# Altium project SeniorProject.PrjPCB
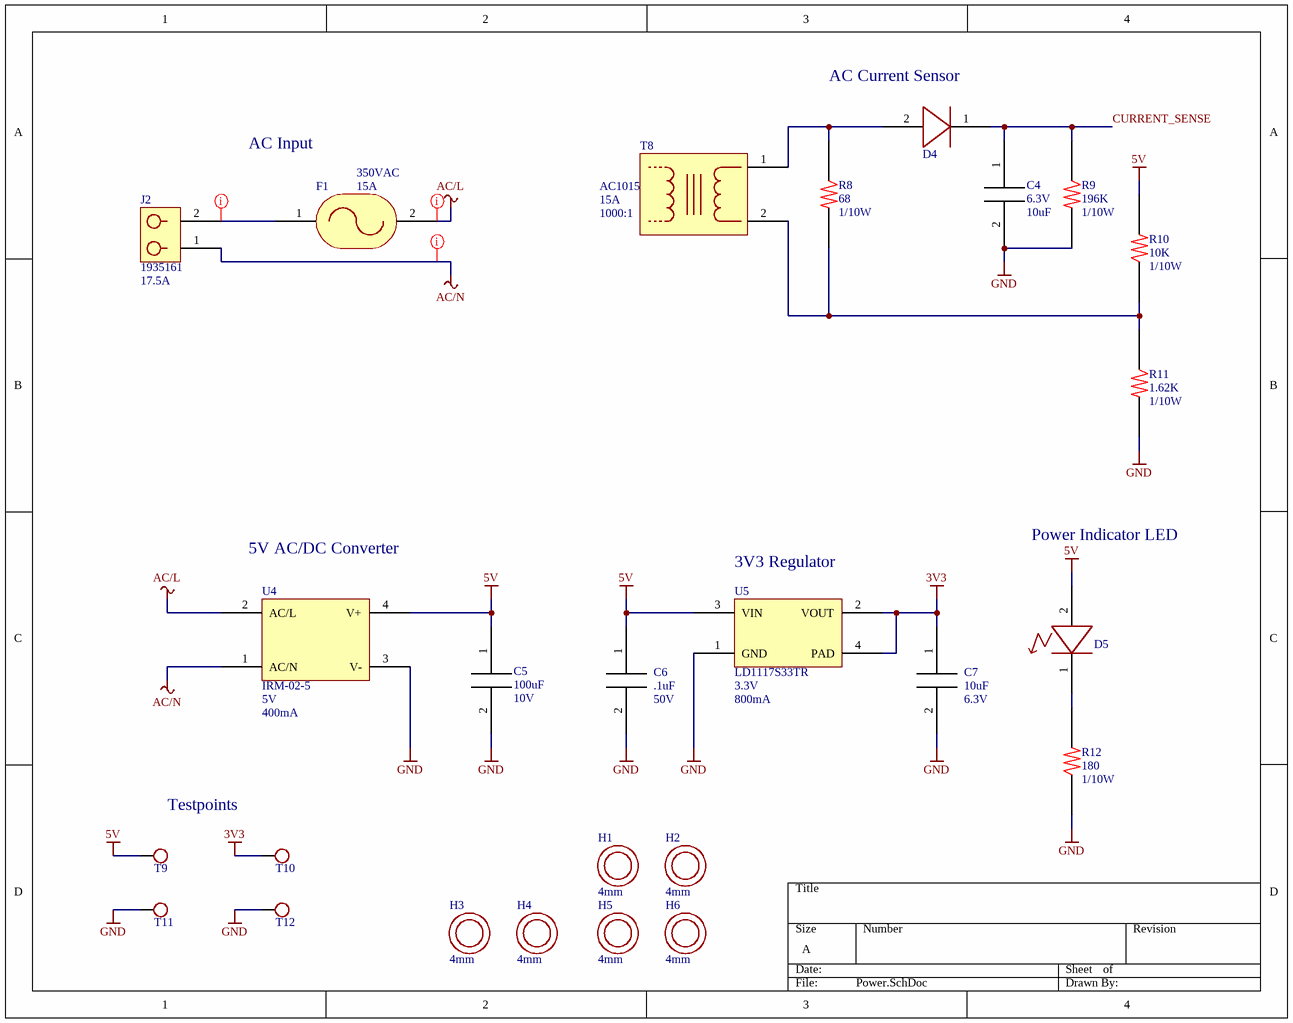
[diagram p0: Power.SchDoc]
4 sheets, 96 parts. Net scope: global (net labels, ports and power ports of the same name join across sheets).
Board file: LightSwitch.PcbDoc
Sheets:
  Power.SchDoc
  Dimmer.SchDoc
  XBee.SchDoc
  Logic.SchDoc

## Sheet Power.SchDoc
size A

### Parts
(Parts that share a designator on the sheet are numbered #1, #2 ... from top to bottom, then left to right.)
C4#1  value 10uF  Rating: 6.3V  [0603]  (hidden comment: C_CAP_0603)
C5#1  value 100uF  Rating: 10V  [1210]  (hidden comment: C_CAP_1210)
C6#1  value .1uF  Rating: 50V  [0603]  (hidden comment: C_CAP_0603)
C7#1  value 10uF  Rating: 6.3V  [0603]  (hidden comment: C_CAP_0603)
D4#1  D_DIODE_SOD123  [SOD123]  (value not drawn)
D5#1  D_LED_LED5MM  [LED5MM]  (value not drawn)
F1  value 15A  Rating: 350VAC  [2410]  (hidden comment: F_FUSE_2410)
H1  value 4mm  [MOUNTHOLE4MM]  (hidden comment: H_MOUNTHOLE_MOUNTHOLE4MM)
H2  value 4mm  [MOUNTHOLE4MM]  (hidden comment: H_MOUNTHOLE_MOUNTHOLE4MM)
H3  value 4mm  [MOUNTHOLE4MM]  (hidden comment: H_MOUNTHOLE_MOUNTHOLE4MM)
H4  value 4mm  [MOUNTHOLE4MM]  (hidden comment: H_MOUNTHOLE_MOUNTHOLE4MM)
H5  value 4mm  [MOUNTHOLE4MM]  (hidden comment: H_MOUNTHOLE_MOUNTHOLE4MM)
H6  value 4mm  [MOUNTHOLE4MM]  (hidden comment: H_MOUNTHOLE_MOUNTHOLE4MM)
J2#1  Rating: 17.5A  [1935161]  (hidden comment: J_2POSTERM_1935161)
R8#1  value 68  Rating: 1/10W  [0603]  (hidden comment: R_RES_0603)
R9  value 196K  Rating: 1/10W  [0603]  (hidden comment: R_RES_0603)
R10#1  value 10K  Rating: 1/10W  [0603]  (hidden comment: R_RES_0603)
R11#1  value 1.62K  Rating: 1/10W  [0603]  (hidden comment: R_RES_0603)
R12#1  value 180  Rating: 1/10W  [0603]  (hidden comment: R_RES_0603)
T8  value 1000:1  Rating: 15A  [AC1015]  (hidden comment: T_CURRTRANS_AC1015)
T9  TESTPOINT  [TESTPOINT1MM]  (value not drawn)
T10  TESTPOINT  [TESTPOINT1MM]  (value not drawn)
T11  TESTPOINT  [TESTPOINT1MM]  (value not drawn)
T12  TESTPOINT  [TESTPOINT1MM]  (value not drawn)
U4  value 5V  Rating: 400mA  [IRM-02-5]  (hidden comment: U_IRM-02-5_IRM-02-5)
U5  value 3.3V  Rating: 800mA  PartNumber: LD1117S33TR  [SOT223]  (hidden comment: U_LD1117S33TR_SOT223)

### Nets
3V3: C7#1.1 T10.1 U5.2(VOUT) U5.4(PAD)
5V: C5#1.1 C6#1.1 D5#1.2 R10#1.2 T9.1 U4.4(V+) U5.3(VIN)
AC/L: F1.2 U4.2(AC/L)
AC/N: J2#1.1 U4.1(AC/N)
GND: C4#1.2 C5#1.2 C6#1.2 C7#1.2 R9.2 R11#1.2 R12#1.1 T11.1 T12.1 U4.3(V-) U5.1(GND)
CURRENT_SENSE: C4#1.1 D4#1.1 R9.1
NetD4#1_2: D4#1.2 R8#1.1 T8.1
NetD5#1_1: D5#1.1 R12#1.2
NetF1_1: F1.1 J2#1.2
NetR8#1_2: R8#1.2 R10#1.1 R11#1.1 T8.2

### Layout directives
rule Width Constraint [Pref Width = 100mil    Min Width = 15mil    Max Width = 250mil]; rule Clearance Constraint [Generic clearance = 45mil, and 18 value(s) for objects]: AC/L, AC/N, NetF1_1

### Notes on the sheet
- (near D4#1) AC Current Sensor
- AC Input
- 5V AC/DC Converter
- (near U5) 3V3 Regulator
- Power Indicator LED
- Testpoints

### Library data of the parts
C4#1 C7#1 = C_CAP_0603: PartNumber: JMK107ABJ106MA-T; Manufacturer: Taiyo Yuden
C5#1 = C_CAP_1210: PartNumber: GRM32ER61A107ME20L; Manufacturer: Murata
C6#1 = C_CAP_0603: PartNumber: C0603C104K5RACAUTO; Manufacturer: KEMET
D4#1 = D_DIODE_SOD123: PartNumber: BAS16GWJ; Manufacturer: Nexperia USA Inc; Rating: 215mA
F1 = F_FUSE_2410: PartNumber: 0679H9150-05; Manufacturer: Bel Fuse
J2#1 = J_2POSTERM_1935161: Manufacturer: Phoenix Contact; PartNumber: 1935161
R8#1 = R_RES_0603: PartNumber: RC0603FR-0768RL; Manufacturer: Yageo
R9 = R_RES_0603: PartNumber: RC0603FR-07196KL; Manufacturer: Yageo
R10#1 = R_RES_0603: PartNumber: RC0603JR-0710KL; Manufacturer: Yageo
R11#1 = R_RES_0603: PartNumber: RC0603FR-071K62L; Manufacturer: Yageo
R12#1 = R_RES_0603: PartNumber: RC0603JR-07180RL; Manufacturer: Yageo
T8 = T_CURRTRANS_AC1015: Manufacturer: Acme Electric/Amveco/Actown; PartNumber: AC1015
T9-T12 = T_TESTPOINT_TESTPOINT1MM: Value: 1mm
U5 = U_LD1117S33TR_SOT223: Manufacturer: STM
H1-H6 = H_MOUNTHOLE_MOUNTHOLE4MM: PartNumber: *
U4 = U_IRM-02-5_IRM-02-5: PartNumber: IRM-02-5

## Sheet Dimmer.SchDoc
size A4
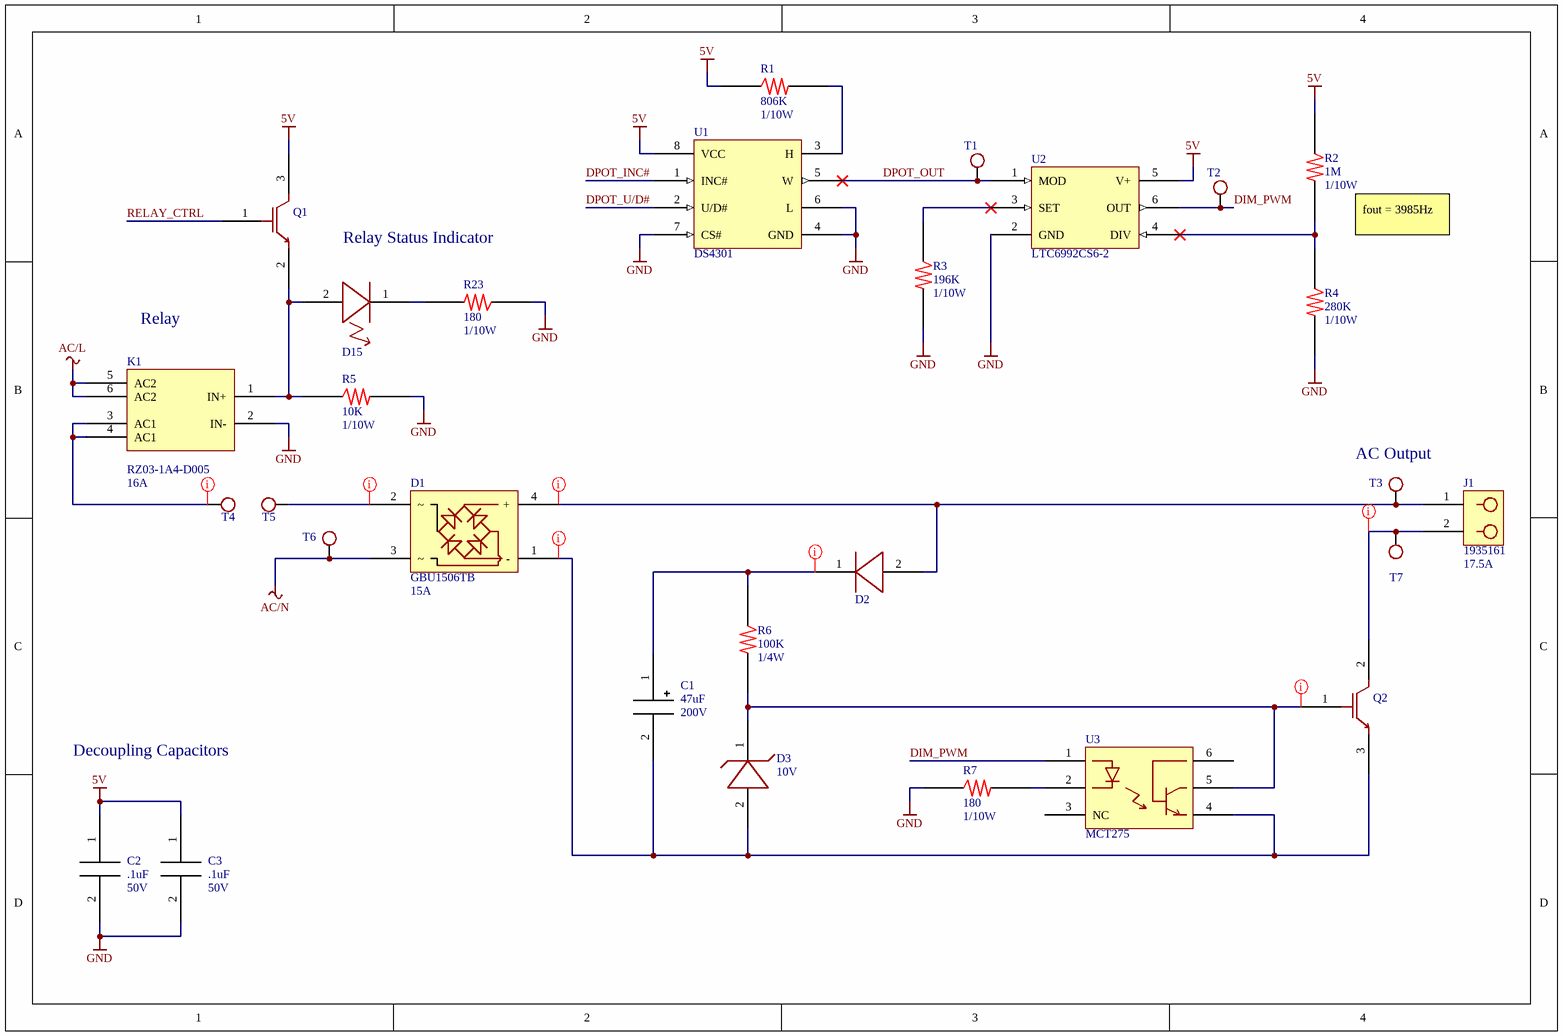
[diagram p1: Dimmer.SchDoc]

### Parts
(Parts that share a designator on the sheet are numbered #1, #2 ... from top to bottom, then left to right.)
C1#1  value 47uF  Rating: 200V  [CAP12.5X20]  (hidden comment: CAP)
C2#1  value .1uF  Rating: 50V  [0603]  (hidden comment: C_CAP_0603)
C3#1  value .1uF  Rating: 50V  [0603]  (hidden comment: C_CAP_0603)
D1  Rating: 15A  PartNumber: GBU1506TB  [GBU]  (hidden comment: D_RECTBRIDGE_GBU1506TB)
D2  D_DIODE_SOD123  [SOD123]  (value not drawn)
D3#1  value 10V  [SOD323]  (hidden comment: D_ZENER_SOD323)
D15  D_LED_LED5MM  [LED5MM]  (value not drawn)
J1#1  Rating: 17.5A  [1935161]  (hidden comment: J_2POSTERM_1935161)
K1  Rating: 16A  [RZ03-1A4-D005]  (hidden comment: K_RELAY-RZ03-1A4_RZ03-1A4-D005)
Q1  Q_NFET_SOT23  [SOT23]  (value not drawn)
Q2  Q_NFET_TO252  [TO252]  (value not drawn)
R1#1  value 806K  Rating: 1/10W  [0603]  (hidden comment: R_RES_0603)
R2#1  value 1M  Rating: 1/10W  [0603]  (hidden comment: R_RES_0603)
R3  value 196K  Rating: 1/10W  [0603]  (hidden comment: R_RES_0603)
R4#1  value 280K  Rating: 1/10W  [0603]  (hidden comment: R_RES_0603)
R5  value 10K  Rating: 1/10W  [0603]  (hidden comment: R_RES_0603)
R6#1  value 100K  Rating: 1/4W  [1206]  (hidden comment: R_RES_1206)
R7  value 180  Rating: 1/10W  [0603]  (hidden comment: R_RES_0603)
R23  value 180  Rating: 1/10W  [0603]  (hidden comment: R_RES_0603)
T1  TESTPOINT  [TESTPOINT1MM]  (value not drawn)
T2  TESTPOINT  [TESTPOINT1MM]  (value not drawn)
T3  TESTPOINT  [TESTPOINT2.5MM]  (value not drawn)
T4  TESTPOINT  [TESTPOINT2.5MM]  (value not drawn)
T5  TESTPOINT  [TESTPOINT2.5MM]  (value not drawn)
T6  TESTPOINT  [TESTPOINT2.5MM]  (value not drawn)
T7  TESTPOINT  [TESTPOINT2.5MM]  (value not drawn)
U1#1  PartNumber: DS4301  [MSOP8]  (hidden comment: U_DS4301_MSOP8)
U2  PartNumber: LTC6992CS6-2  [SOT23-6]  (hidden comment: U_LTC6992CS6-2_SOT23-6)
U3#1  PartNumber: MCT275  [DIP6]  (hidden comment: U_MCT275_DIP6)

### Nets
5V: C2#1.1 C3#1.1 Q1.3(D) R1#1.1 R2#1.1 U1#1.8(VCC) U2.5(V+)
AC/L: K1.5(AC2) K1.6(AC2)
AC/N: D1.3 T6.1
GND: C2#1.2 C3#1.2 K1.2(IN-) R3.2 R4#1.2 R5.2 R7.1 R23.1 U1#1.4(GND) U1#1.6(L) U1#1.7(CS#) U2.2(GND)
DIM_PWM: T2.1 U2.6(OUT) U3#1.1
DPOT_INC#: U1#1.1(INC#)
DPOT_OUT: T1.1 U1#1.5(W) U2.1(MOD)
DPOT_U/D#: U1#1.2(U/D#)
RELAY_CTRL: Q1.1(G)
NetC1#1_1: C1#1.1 D2.1 R6#1.1
NetC1#1_2: C1#1.2 D1.1(-) D3#1.2 Q2.3(S) U3#1.4
NetD1_2: D1.2 T5.1
NetD1_4: D1.4(+) D2.2 J1#1.1 T3.1
NetD3#1_1: D3#1.1 Q2.1(G) R6#1.2 U3#1.5
NetD15_1: D15.1 R23.2
NetD15_2: D15.2 K1.1(IN+) Q1.2(S) R5.1
NetJ1#1_2: J1#1.2 Q2.2(D) T7.1
NetK1_3: K1.3(AC1) K1.4(AC1) T4.1
NetR1#1_2: R1#1.2 U1#1.3(H)
NetR2#1_2: R2#1.2 R4#1.1 U2.4(DIV)
NetR3_1: R3.1 U2.3(SET)
NetR7_2: R7.2 U3#1.2

Not connected (* = marked no-connect by the designer): U3#1 3(NC) 6

### Layout directives
rule Width Constraint [Pref Width = 100mil    Min Width = 15mil    Max Width = 250mil]; rule Clearance Constraint [Generic clearance = 45mil, and 18 value(s) for objects]: NetC1#1_1, NetC1#1_2, NetD1_2, NetD1_4, NetD3#1_1, NetJ1#1_2, NetK1_3

### Notes on the sheet
- Relay Status Indicator
- fout = 3985Hz
- Relay
- (near T3) AC Output
- Decoupling Capacitors

### Library data of the parts
C1#1 = C_CAP-P_CAP12.5X20: PartNumber: UVR2D470MHD1TO; Manufacturer: Nichicon
C2#1 C3#1 = C_CAP_0603: as C6#1 on sheet Power
D1 = D_RECTBRIDGE_GBU1506TB: Manufacturer: SMC Diode Solutions
D2 = D_DIODE_SOD123: as D4#1 on sheet Power
D3#1 = D_ZENER_SOD323: PartNumber: MM3Z10VT1G; Manufacturer: On Semiconductor; Rating: 300mW
J1#1 = J_2POSTERM_1935161: Manufacturer: Phoenix Contact; PartNumber: 1935161
K1 = K_RELAY-RZ03-1A4_RZ03-1A4-D005: Manufacturer: TE Connectivity / Potter and Brumfield; PartNumber: RZ03-1A4-D005
Q1 = Q_NFET_SOT23: Manufacturer: On Semiconductor; PartNumber: BSS138; Rating: 220mA
Q2 = Q_NFET_TO252: Manufacturer: Infineon Technologies; PartNumber: IPD50R280CEAUMA1; Rating: 18.1A
R1#1 = R_RES_0603: PartNumber: RC0603FR-07806KL; Manufacturer: Yageo
R2#1 = R_RES_0603: PartNumber: RC0603FR-071ML; Manufacturer: Yageo
R3 = R_RES_0603: as R9 on sheet Power
R4#1 = R_RES_0603: PartNumber: RC0603FR-07280KL; Manufacturer: Yageo
R5 = R_RES_0603: as R10#1 on sheet Power
R6#1 = R_RES_1206: PartNumber: RC1206JR-07100KL; Manufacturer: Yageo
R7 R23 = R_RES_0603: as R12#1 on sheet Power
T1 T2 = T_TESTPOINT_TESTPOINT1MM: Value: 1mm
T3-T7 = T_TESTPOINT_TESTPOINT2.5MM: Value: 2.54mm
U1#1 = U_DS4301_MSOP8: Manufacturer: Maxim; Value: 200K
U2 = U_LTC6992CS6-2_SOT23-6: Manufacturer: Linear
U3#1 = U_MCT275_DIP6: Manufacturer: Vishay

## Sheet XBee.SchDoc
size A
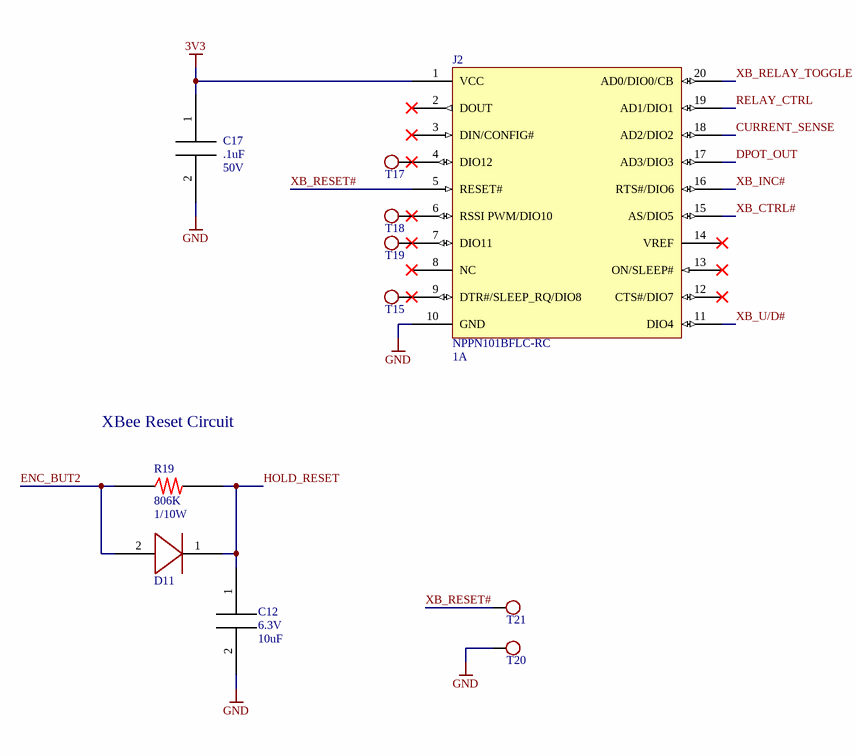
[diagram p2: XBee.SchDoc]

### Parts
(Parts that share a designator on the sheet are numbered #1, #2 ... from top to bottom, then left to right.)
C12  value 10uF  Rating: 6.3V  [0603]  (hidden comment: C_CAP_0603)
C17  value .1uF  Rating: 50V  [0603]  (hidden comment: C_CAP_0603)
D11  D_DIODE_SOD123  [SOD123]  (value not drawn)
J2#2  Rating: 1A  [NPPN101BFLC-RC]  (hidden comment: J_XBEE_NPPN101BFLC-RC)
R19  value 806K  Rating: 1/10W  [0603]  (hidden comment: R_RES_0603)
T15  TESTPOINT  [TESTPOINT1MM]  (value not drawn)
T17  TESTPOINT  [TESTPOINT1MM]  (value not drawn)
T18  TESTPOINT  [TESTPOINT1MM]  (value not drawn)
T19  TESTPOINT  [TESTPOINT1MM]  (value not drawn)
T20  TESTPOINT  [TESTPOINT1MM]  (value not drawn)
T21  TESTPOINT  [TESTPOINT1MM]  (value not drawn)

### Nets
3V3: C17.1 J2#2.1(VCC)
GND: C12.2 C17.2 J2#2.10(GND) T20.1
CURRENT_SENSE: J2#2.18(AD2/DIO2)
DPOT_OUT: J2#2.17(AD3/DIO3)
ENC_BUT2: D11.2 R19.1
HOLD_RESET: C12.1 D11.1 R19.2
RELAY_CTRL: J2#2.19(AD1/DIO1)
XB_CTRL#: J2#2.15(AS/DIO5)
XB_INC#: J2#2.16(RTS#/DIO6)
XB_RELAY_TOGGLE: J2#2.20(AD0/DIO0/CB)
XB_RESET#: J2#2.5(RESET#) T21.1
XB_U/D#: J2#2.11(DIO4)
NetJ2#2_4: J2#2.4(DIO12) T17.1
NetJ2#2_6: J2#2.6(RSSI_PWM/DIO10) T18.1
NetJ2#2_7: J2#2.7(DIO11) T19.1
NetJ2#2_9: J2#2.9(DTR#/SLEEP_RQ/DIO8) T15.1

Not connected (* = marked no-connect by the designer): J2#2 2(DOUT)* 3(DIN/CONFIG#)* 8(NC)* 12(CTS#/DIO7)* 13(ON/SLEEP#)* 14(VREF)*

### Notes on the sheet
- XBee Reset Circuit

### Library data of the parts
C12 = C_CAP_0603: as C4#1 on sheet Power
C17 = C_CAP_0603: as C6#1 on sheet Power
D11 = D_DIODE_SOD123: as D4#1 on sheet Power
J2#2 = J_XBEE_NPPN101BFLC-RC: Manufacturer: Sullins Connector Solutions; PartNumber: NPPN101BFLC-RC
R19 = R_RES_0603: as R1#1 on sheet Dimmer
T15 T17-T21 = T_TESTPOINT_TESTPOINT1MM: Value: 1mm

## Sheet Logic.SchDoc
size A3
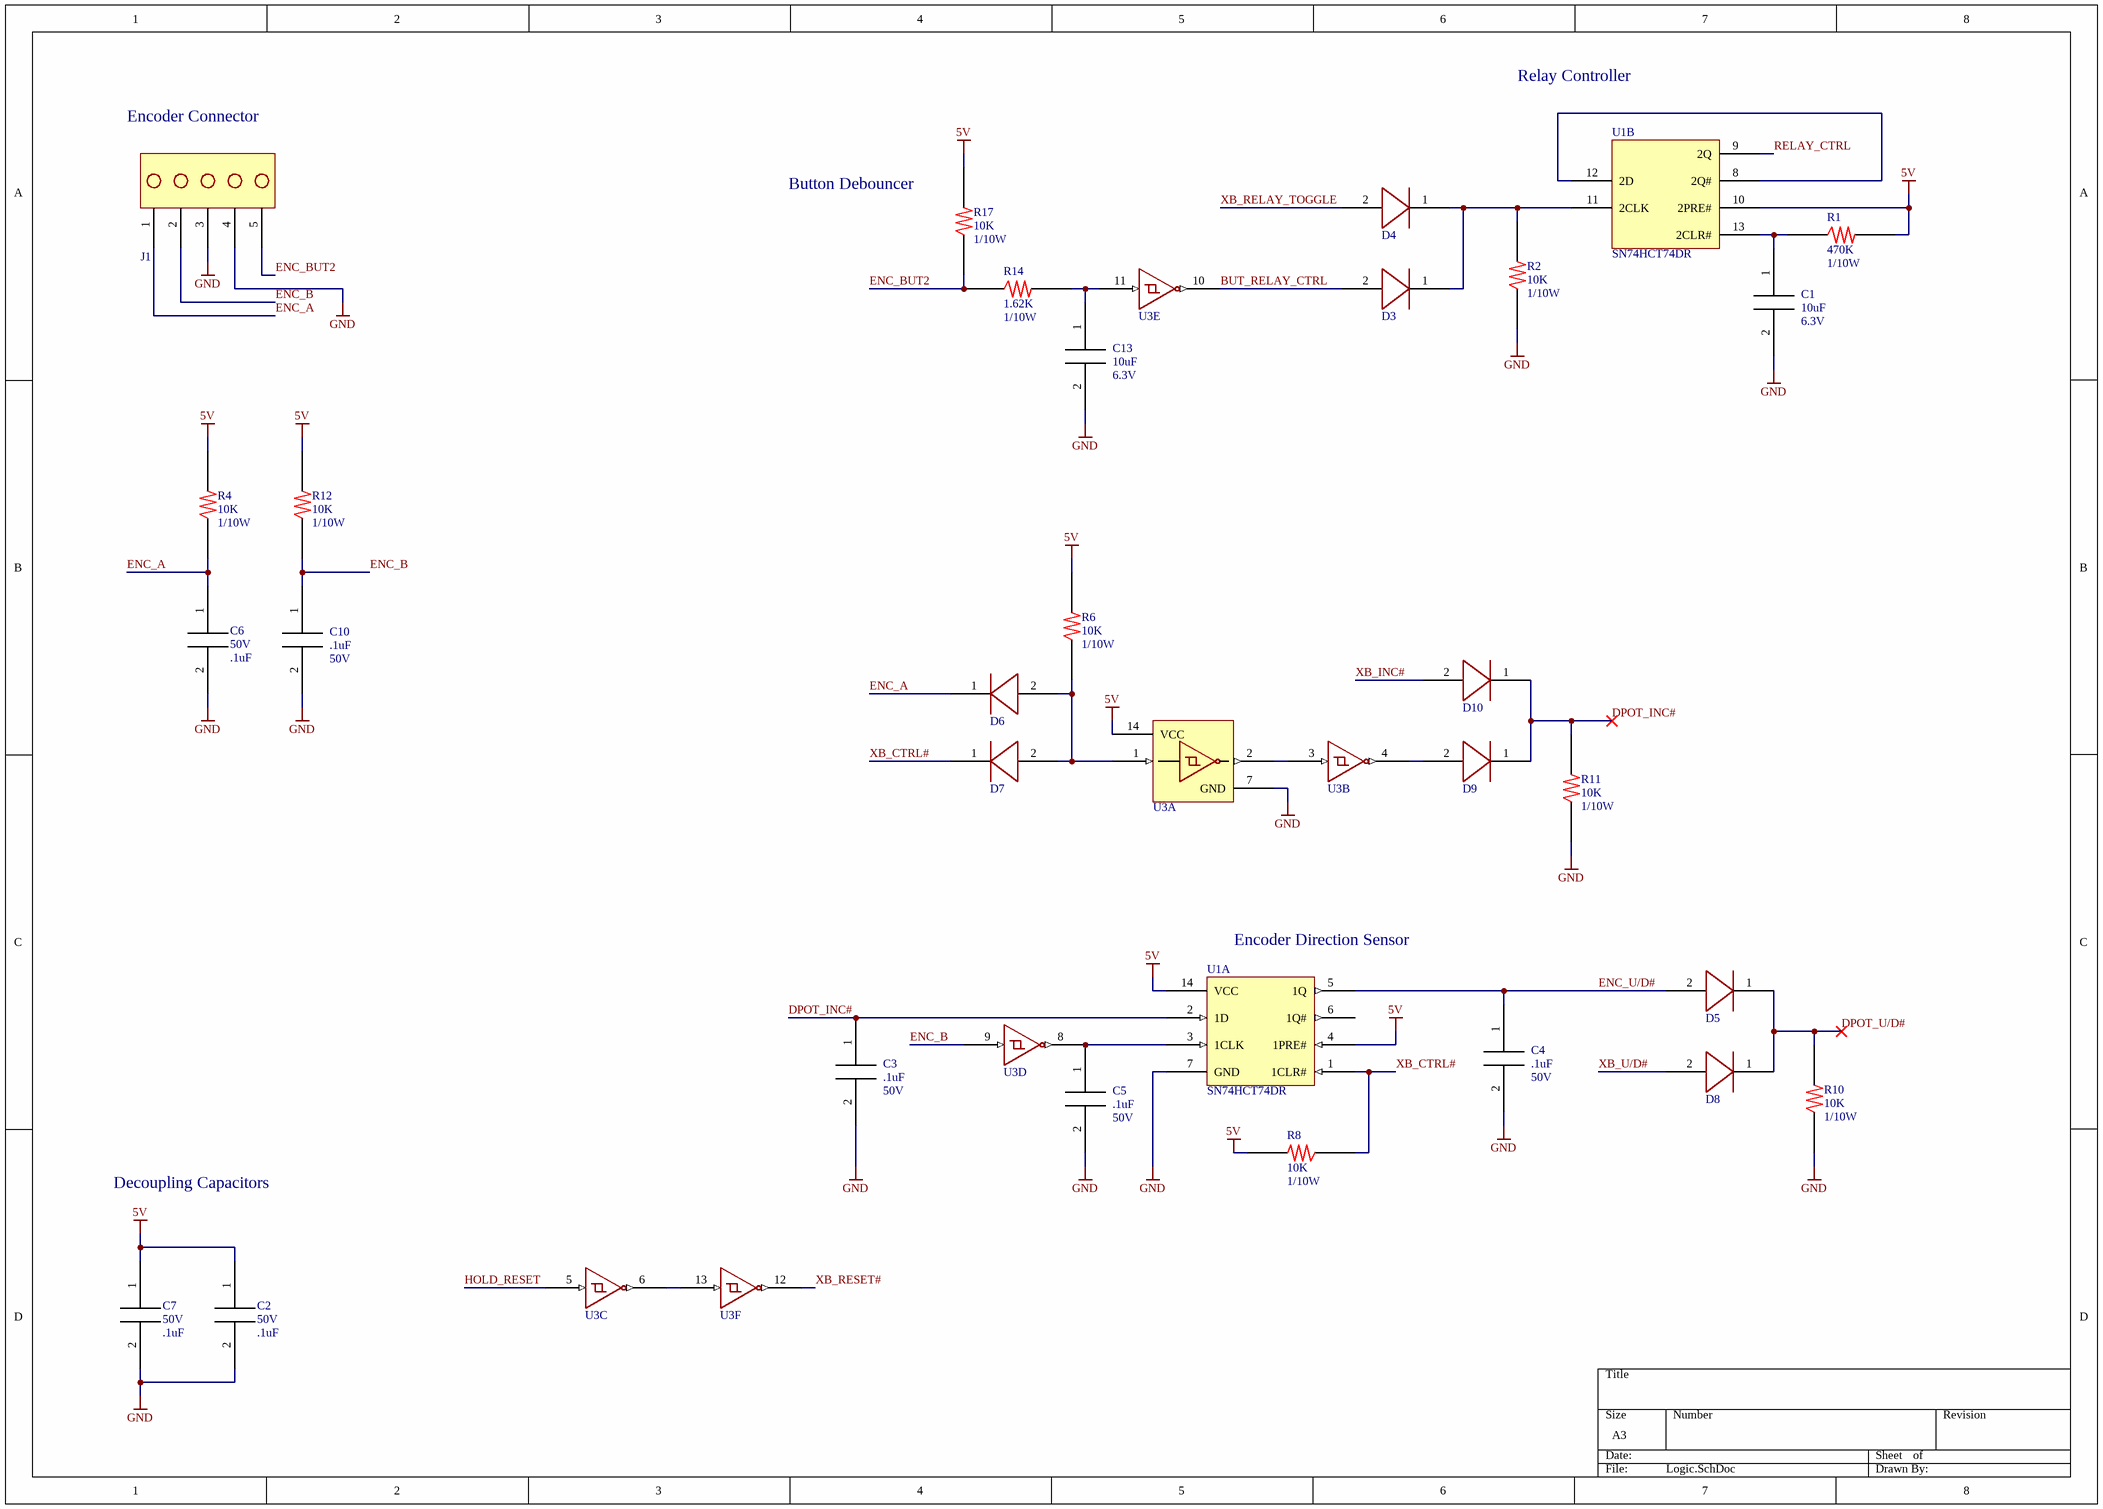
[diagram p3: Logic.SchDoc]

### Parts
(Parts that share a designator on the sheet are numbered #1, #2 ... from top to bottom, then left to right.)
C1#2  value 10uF  Rating: 6.3V  [0603]  (hidden comment: C_CAP_0603)
C2#2  value .1uF  Rating: 50V  [0603]  (hidden comment: C_CAP_0603)
C3#2  value .1uF  Rating: 50V  [0603]  (hidden comment: C_CAP_0603)
C4#2  value .1uF  Rating: 50V  [0603]  (hidden comment: C_CAP_0603)
C5#2  value .1uF  Rating: 50V  [0603]  (hidden comment: C_CAP_0603)
C6#2  value .1uF  Rating: 50V  [0603]  (hidden comment: C_CAP_0603)
C7#2  value .1uF  Rating: 50V  [0603]  (hidden comment: C_CAP_0603)
C10  value .1uF  Rating: 50V  [0603]  (hidden comment: C_CAP_0603)
C13  value 10uF  Rating: 6.3V  [0603]  (hidden comment: C_CAP_0603)
D3#2  D_DIODE_SOD123  [SOD123]  (value not drawn)
D4#2  D_DIODE_SOD123  [SOD123]  (value not drawn)
D5#2  D_DIODE_SOD123  [SOD123]  (value not drawn)
D6  D_DIODE_SOD123  [SOD123]  (value not drawn)
D7  D_DIODE_SOD123  [SOD123]  (value not drawn)
D8  D_DIODE_SOD123  [SOD123]  (value not drawn)
D9  D_DIODE_SOD123  [SOD123]  (value not drawn)
D10  D_DIODE_SOD123  [SOD123]  (value not drawn)
J1#2  J_RIBBCONN_RIBBCONN  [RIBBCONN]  (value not drawn)
R1#2  value 470K  Rating: 1/10W  [0603]  (hidden comment: R_RES_0603)
R2#2  value 10K  Rating: 1/10W  [0603]  (hidden comment: R_RES_0603)
R4#2  value 10K  Rating: 1/10W  [0603]  (hidden comment: R_RES_0603)
R6#2  value 10K  Rating: 1/10W  [0603]  (hidden comment: R_RES_0603)
R8#2  value 10K  Rating: 1/10W  [0603]  (hidden comment: R_RES_0603)
R10#2  value 10K  Rating: 1/10W  [0603]  (hidden comment: R_RES_0603)
R11#2  value 10K  Rating: 1/10W  [0603]  (hidden comment: R_RES_0603)
R12#2  value 10K  Rating: 1/10W  [0603]  (hidden comment: R_RES_0603)
R14  value 1.62K  Rating: 1/10W  [0603]  (hidden comment: R_RES_0603)
R17  value 10K  Rating: 1/10W  [0603]  (hidden comment: R_RES_0603)
U1#2  PartNumber: SN74HCT74DR  [SOIC14]  (hidden comment: U_DUALDFLIP_SOIC14)  (parts A,B of 2)
U3#2  U_SN74HCT04DR_SOIC14  [SOIC14]  (value not drawn)  (parts A,B,C,D,E,F of 6)

### Nets
5V: C2#2.1 C7#2.1 R1#2.2 R4#2.2 R6#2.2 R8#2.2 R12#2.2 R17.2 U1#2.4(1PRE#) U1#2.10(2PRE#) U1#2.14(VCC) U3#2.14(VCC)
GND: C1#2.2 C2#2.2 C3#2.2 C4#2.2 C5#2.2 C6#2.2 C7#2.2 C10.2 C13.2 J1#2.3 J1#2.4 R2#2.1 R10#2.1 R11#2.1 U1#2.7(GND) U3#2.7(GND)
BUT_RELAY_CTRL: D3#2.2 U3#2.10
DPOT_INC#: C3#2.1 D9.1 D10.1 R11#2.2 U1#2.2(1D)
DPOT_U/D#: D5#2.1 D8.1 R10#2.2
ENC_A: C6#2.1 D6.1 J1#2.1 R4#2.1
ENC_B: C10.1 J1#2.2 R12#2.1 U3#2.9
ENC_BUT2: J1#2.5 R14.1 R17.1
ENC_U/D#: C4#2.1 D5#2.2 U1#2.5(1Q)
HOLD_RESET: U3#2.5
RELAY_CTRL: U1#2.9(2Q)
XB_CTRL#: D7.1 R8#2.1 U1#2.1(1CLR#)
XB_INC#: D10.2
XB_RELAY_TOGGLE: D4#2.2
XB_RESET#: U3#2.12
XB_U/D#: D8.2
NetC1#2_1: C1#2.1 R1#2.1 U1#2.13(2CLR#)
NetC5#2_1: C5#2.1 U1#2.3(1CLK) U3#2.8
NetC13_1: C13.1 R14.2 U3#2.11
NetD3#2_1: D3#2.1 D4#2.1 R2#2.2 U1#2.11(2CLK)
NetD6_2: D6.2 D7.2 R6#2.1 U3#2.1
NetD9_2: D9.2 U3#2.4
NetU1#2_8: U1#2.8(2Q#) U1#2.12(2D)
NetU3#2_2: U3#2.2 U3#2.3
NetU3#2_6: U3#2.6 U3#2.13

Not connected (* = marked no-connect by the designer): U1#2 6(1Q#)

### Notes on the sheet
- Relay Controller
- Encoder Connector
- (near R17) Button Debouncer
- (near U1#2) Encoder Direction Sensor
- Decoupling Capacitors

### Library data of the parts
C1#2 C13 = C_CAP_0603: as C4#1 on sheet Power
C2#2 C3#2 C4#2 C5#2 C6#2 C7#2 C10 = C_CAP_0603: as C6#1 on sheet Power
D3#2 D4#2 D5#2 D6-D10 = D_DIODE_SOD123: as D4#1 on sheet Power
R1#2 = R_RES_0603: PartNumber: RC0603JR-07470KL; Manufacturer: Yageo
R2#2 R4#2 R6#2 R8#2 R10#2 R11#2 R12#2 R17 = R_RES_0603: as R10#1 on sheet Power
R14 = R_RES_0603: as R11#1 on sheet Power
U1#2 = U_DUALDFLIP_SOIC14: Manufacturer: TI
U3#2 = U_SN74HCT04DR_SOIC14: Manufacturer: TI; PartNumber: SN74HCT04DR

## Nets that join several sheets
3V3: Power (C7#1.1 T10.1 U5.2 U5.4), XBee (C17.1 J2#2.1)
5V: Power (7 pins), Dimmer (7 pins), Logic (12 pins)
AC/L: Power (F1.2 U4.2), Dimmer (K1.5 K1.6)
AC/N: Power (J2#1.1 U4.1), Dimmer (D1.3 T6.1)
GND: Power (11 pins), Dimmer (12 pins), XBee (C12.2 C17.2 J2#2.10 T20.1), Logic (16 pins)
CURRENT_SENSE: Power (C4#1.1 D4#1.1 R9.1), XBee (J2#2.18)
DPOT_INC#: Dimmer (U1#1.1), Logic (5 pins)
DPOT_OUT: Dimmer (T1.1 U1#1.5 U2.1), XBee (J2#2.17)
DPOT_U/D#: Dimmer (U1#1.2), Logic (D5#2.1 D8.1 R10#2.2)
ENC_BUT2: XBee (D11.2 R19.1), Logic (J1#2.5 R14.1 R17.1)
HOLD_RESET: XBee (C12.1 D11.1 R19.2), Logic (U3#2.5)
RELAY_CTRL: Dimmer (Q1.1), XBee (J2#2.19), Logic (U1#2.9)
XB_CTRL#: XBee (J2#2.15), Logic (D7.1 R8#2.1 U1#2.1)
XB_INC#: XBee (J2#2.16), Logic (D10.2)
XB_RELAY_TOGGLE: XBee (J2#2.20), Logic (D4#2.2)
XB_RESET#: XBee (J2#2.5 T21.1), Logic (U3#2.12)
XB_U/D#: XBee (J2#2.11), Logic (D8.2)